# Altium schematic sheet uInverter.SchDoc: uInverter
size Letter; Engineer: Nikhil Deshpande; Revision: A; SheetNumber: 1; SheetTotal: 3
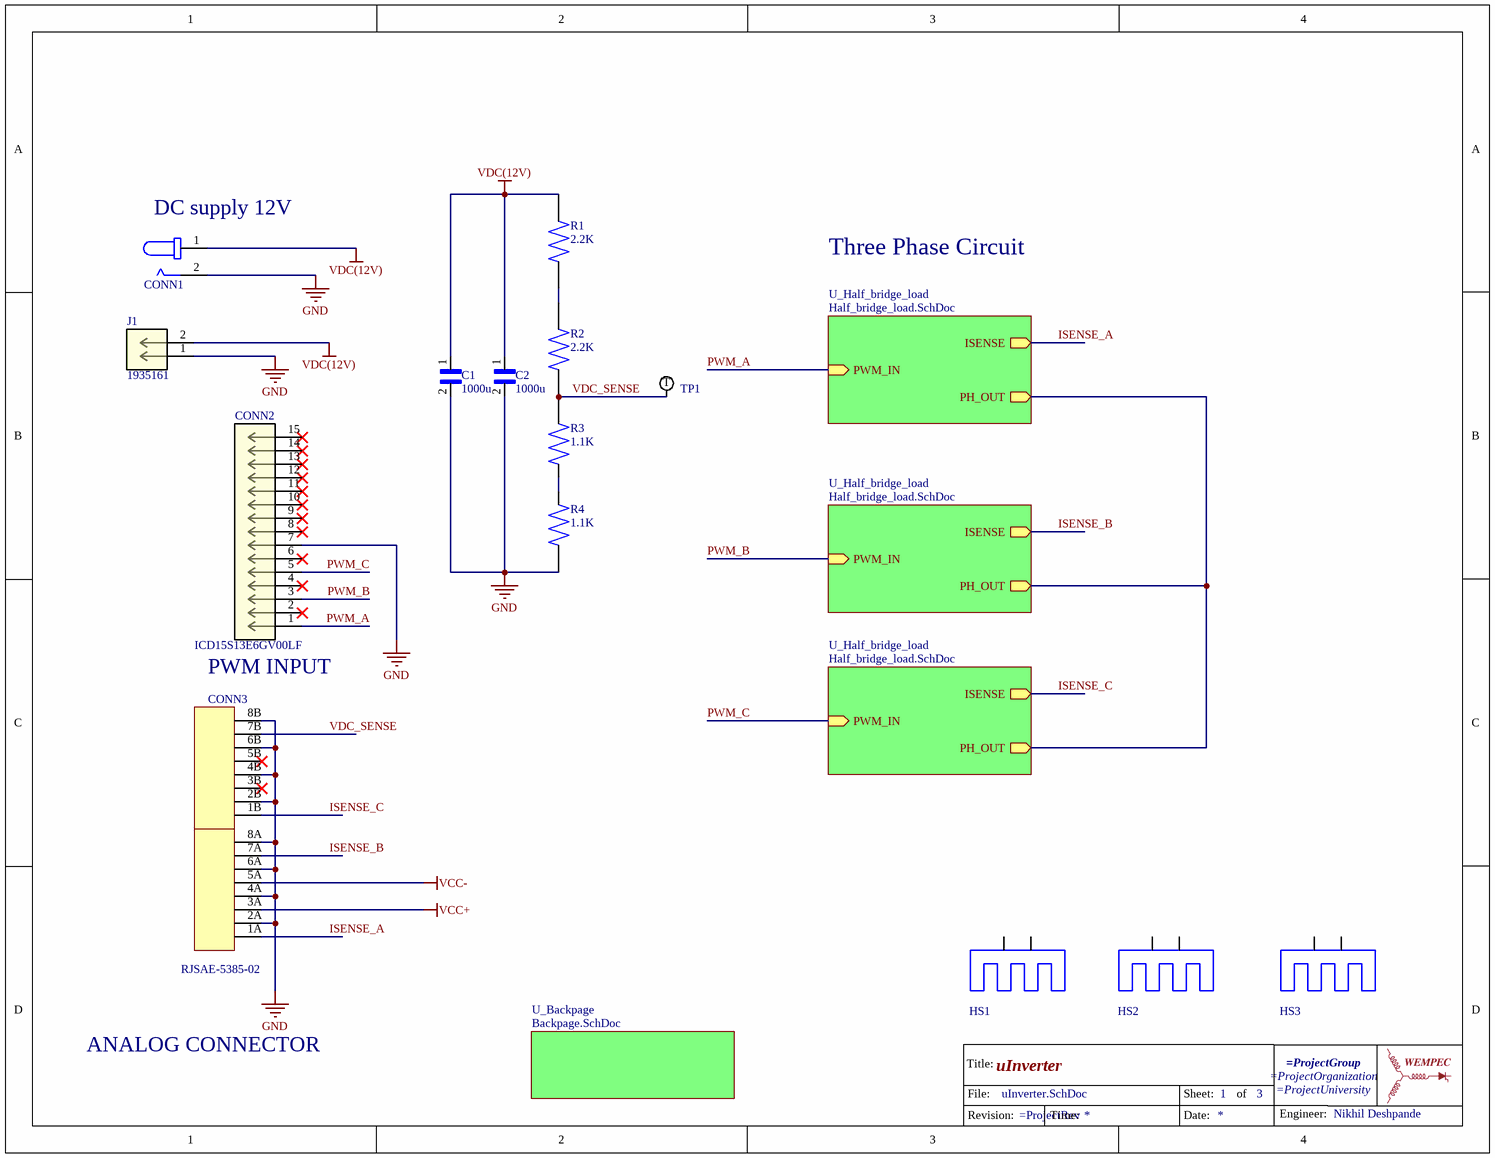
[diagram p0: uInverter.SchDoc]

## Parts
C1  1000u  [CAP_PAN_12.5X25_PAN]
C2  1000u  [CAP_PAN_12.5X25_PAN]
CONN1  PJ-037AH  [CUI_PJ-037AH]  (value not drawn)
CONN2  ICD15S13E6GV00LF  [ICD15S13E6GV00LF]
CONN3  RJSAE-5385-02  [CONN_RJSAE538502_AMP]
HS1  530002B02500G  [530002]  (value not drawn)
HS2  530002B02500G  [530002]  (value not drawn)
HS3  530002B02500G  [530002]  (value not drawn)
J1  1935161  [PHOENIX_1935161]
R1  2.2K  [0603_RES]
R2  2.2K  [0603_RES]
R3  1.1K  [0603_RES]
R4  1.1K  [0603_RES]
TitleBlockWEMPEC1  TitleBlockWEMPEC  (value not drawn)
TP1  Test Point  [TP_1.6MM]  (value not drawn)

## Sub-sheets
U_Backpage = Backpage.SchDoc: no entries
U_Half_bridge_load = Half_bridge_load.SchDoc: ISENSE (out), PWM_IN (in), PH_OUT (out)
U_Half_bridge_load = Half_bridge_load.SchDoc: ISENSE (out), PWM_IN (in), PH_OUT (out)
U_Half_bridge_load = Half_bridge_load.SchDoc: ISENSE (out), PWM_IN (in), PH_OUT (out)

## Nets
GND: C1.2 C2.2 CONN1.2 CONN2.7 CONN3.2A CONN3.2B CONN3.4A CONN3.4B CONN3.6A CONN3.6B CONN3.8A CONN3.8B J1.1 R4.2
VCC+: CONN3.3A
VCC-: CONN3.5A
VDC(12V): C1.1 C2.1 CONN1.1 J1.2 R1.1
ISENSE_A: CONN3.1A ; sheet U_Half_bridge_load/ISENSE
ISENSE_B: CONN3.7A ; sheet U_Half_bridge_load/ISENSE
ISENSE_C: CONN3.1B ; sheet U_Half_bridge_load/ISENSE
PWM_A: CONN2.1 ; sheet U_Half_bridge_load/PWM_IN
PWM_B: CONN2.3 ; sheet U_Half_bridge_load/PWM_IN
PWM_C: CONN2.5 ; sheet U_Half_bridge_load/PWM_IN
VDC_SENSE: CONN3.7B R2.2 R3.1 TP1.1
NetR1_2: R1.2 R2.1
NetR3_2: R3.2 R4.1
(unnamed): sheet U_Half_bridge_load/PH_OUT, sheet U_Half_bridge_load/PH_OUT, sheet U_Half_bridge_load/PH_OUT

Not connected (* = marked no-connect by the designer): CONN2 2* 4* 6* 8* 9* 10* 11* 12* 13* 14* 15*; CONN3 3B(79)* 5B(79)*; HS1 P$1(1) P$2(2); HS2 P$1(1) P$2(2); HS3 P$1(1) P$2(2)

## Notes on the sheet
- (near CONN1) DC supply 12V
- Three Phase Circuit
- PWM INPUT
- ANALOG CONNECTOR
- (in symbol Test Point 36-5005ND) T
- (in symbol TitleBlockWEMPEC) Title:; File:; Sheet:; of; Engineer:; Revision:; Time:; Date:

## Library data of the parts
C1 C2 = EEU-FM1V102B: Cap Aluminum 1000uF 35V 20% (12.5 X 25mm) Radial 5mm 3190mA 7000 hr 105C Ammo Pack; Manufacturer: Panasonic; Capacitance: 1mF; Ripple Current: 3.19A; Life (Hours): 7000Hour; Impedance: 15mR; Polarity: Polar; Lead Diameter: 0.6mm; Supplier 1: Digi-Key; Manufacturer Part Number: EEU-FM1V102B; RoHS: Yes; Category: Aluminum Electrolytic Capacitors; Stock 1: 691; Pricing 1: 1=1.11000, 10=0.84300, 50=0.70060, 100=0.60330 (USD); Mount: Through Hole; Case/Package: Radial; Min Operating Temperature: -40°C; Max Operating Temperature: 105°C; Tolerance: 20%; Termination: Radial; Voltage Rating: 35V; Packaging: Tape and Reel; Package Quantity: 500; Voltage Rating (DC): 35V; ESR (Equivalent Series Resistance): 15mR; Series: FM; Construction: RADIAL; Diameter: 12mm; Length: 25mm; Height: 25mm; Lead Pitch: 5mm; Height - Seated (Max): 1.063inch; Radiation Hardening: No; Lead Free: Lead Free; RoHS Compliant: Yes; ComponentLink1URL: https://datasheet.ciiva.com/11676/aba0000ce108-11676917.pdf?src-supplier=Avnet; ComponentLink1Description: https://datasheet.ciiva.com/11676/aba0000ce108-11676917.pdf?src-supplier=Avnet; Supplier Part Number 1: P19719CT-ND
CONN1 = PJ-037AH: CONN PWR JACK 2X5.5MM SOLDER; Manufacturer: CUI; Shielding: Unshielded; Gender: Male; Current Rating: 5A; Number of Conductors: 2; Voltage Rating: 24V; Insulation Resistance: 100MR; Supplier 1: Digi-Key; Manufacturer Part Number: PJ-037AH; RoHS: Yes; Category: Connectors; Stock 1: 11304; Pricing 1: 1=0.71000, 10=0.66600, 25=0.59920, 50=0.53280, 100=0.51060, 250=0.46620, 500=0.44400, 1000=0.36630, 2500=0.33300 (USD); Mount: Through Hole; Color: Black; Contact Material: Copper; Contact Plating: Nickel; Housing Color: Black; Housing Material: Thermoplastic; Min Operating Temperature: -25°C; Max Operating Temperature: 85°C; Connector Type: Jack; Termination: Solder; Package Quantity: 500; Contact Gender: Male; Orientation: Horizontal; Series: -; Flammability Rating: UL94 V-0; Lead Free: Lead Free; RoHS Compliant: Yes; ComponentLink1URL: http://www.mouser.com/ds/2/670/pj-037ah-516064.pdf?src-supplier=Mouser; ComponentLink1Description: http://www.mouser.com/ds/2/670/pj-037ah-516064.pdf?src-supplier=Mouser; ComponentLink2URL: https://www.cui.com/product/resource/digikeypdf/pj-037ah.pdf?src-supplier=Digi-Key; ComponentLink2Description: https://www.cui.com/product/resource/digikeypdf/pj-037ah.pdf?src-supplier=Digi-Key; Supplier Part Number 1: CP-037AH-ND
CONN2 = ICD15S13E6GV00LF: Conn High Density D-Sub SKT 15 POS 2.28mm Solder RA Thru-Hole 15 Terminal 1 Port; Manufacturer: Amphenol FCI; Plating: Bright,Tin,Steel,Chrome; Body Material: Metal,Steel; Number of Terminals/Pins: 15; Mating Cycles: 500; Voltage Rating: 300V; Current Rating: 3A; Gender: Female; Connector Type: D-Sub,Receptacle,Signal; Number of Ports: 1; Supplier 1: Digi-Key; Manufacturer Part Number: ICD15S13E6GV00LF; RoHS: Yes; Category: D-Sub Connectors; Stock 1: 3485; Pricing 1: 1=2.28000, 10=2.06800, 25=1.94120, 50=1.85680, 100=1.77230, 250=1.60352, 500=1.47692, 1000=1.26593, 2500=1.18154 (USD); Mount: Through Hole; Case/Package: Metal; Color: Black; Contact Plating: Gold,Tin,Matte; Contact Material: Copper Alloy; Housing Color: Black; Housing Material: Steel; Min Operating Temperature: -55°C; Max Operating Temperature: 125°C; Packaging: Bulk; Package Quantity: 100; Number of Rows: 3; Max Voltage Rating (AC): 300V; Number of Positions: 15; Termination: Solder; Number of Contacts: 15; Max Supply Voltage (AC): 300V; Orientation: Right Angle; Length: 30.81mm; Width: 12.58mm; Pitch: 2.28mm; Depth: 21.7mm; Radiation Hardening: No; REACH SVHC: No SVHC; Lead Free: Lead Free; Flammability Rating: UL94 V-0; ComponentLink1URL: https://datasheet.ciiva.com/22727/1728476-22727809.pdf?src-supplier=Element14; ComponentLink1Description: https://datasheet.ciiva.com/22727/1728476-22727809.pdf?src-supplier=Element14; ComponentLink2URL: https://datasheet.ciiva.com/652/c-cd-0011-652471.pdf?src-supplier=Digi-Key; ComponentLink2Description: https://datasheet.ciiva.com/652/c-cd-0011-652471.pdf?src-supplier=Digi-Key; ComponentLink3URL: https://datasheet.ciiva.com/8058/1728476-8058812.pdf?src-supplier=Element14; ComponentLink3Description: https://datasheet.ciiva.com/8058/1728476-8058812.pdf?src-supplier=Element14; Supplier Part Number 1: 609-2802-ND
CONN3 = RJSAE-5385-02: CONN MOD JACK 8P8C R/A SHIELDED; Manufacturer: Amphenol Commercial; Number of Contacts: 16; Gender: Female; Current Rating: 1.5A; Voltage Rating: 125V; Number of Ports: 2; Direction: Up and Down; Pitch: 2.54mm; Supplier 1: Digi-Key; Manufacturer Part Number: RJSAE-5385-02; RoHS: Yes; Category: Modular / Ethernet Connectors; Stock 1: 254; Pricing 1: 1=6.67000, 10=6.39000, 25=5.83440, 50=5.55660, 100=5.27880, 250=4.72312, 500=4.44528, 1000=4.01310 (USD); Mount: Through Hole; Color: Black,Green; Contact Plating: Gold; Contact Material: Bronze; Housing Material: Thermoplastic; Min Operating Temperature: -55°C; Max Operating Temperature: 85°C; Termination: Solder; Orientation: Right Angle; Package Quantity: 35; Packaging: Tray; Shielding: Shielded; Number of Rows: 2; Number of Positions Loaded: 16; Connector Type: Jack; Series: RJSAE; Length: 16.51mm; Depth: 28.15mm; Radiation Hardening: No; Lead Free: Lead Free; RoHS Compliant: Yes; ComponentLink1URL: https://datasheet.ciiva.com/26934/getdatasheetpartid-29521-26934348.pdf?src-supplier=Verical; ComponentLink1Description: https://datasheet.ciiva.com/26934/getdatasheetpartid-29521-26934348.pdf?src-supplier=Verical; Supplier Part Number 1: RJSAE-5385-02-ND
HS1-HS3 = 530002B02500G: Heat Sink Passive TO-220 Radial Thru-Hole 2.6C/W Black Anodized; MF: Aavid Thermalloy; Shape: Fins,Rectangular; Thermal Resistance @ Forced Air Flow (100 LFM): 2°C/W; Natural Thermal Resistance: 2.6°C/W; Package: None; SnapEDA_Link: https://www.snapeda.com/parts/530002B02500G/Aavid%20Thermalloy/view-part/4792019/?ref=snap; Availability: Unavailable; Value: *; MP: 530002B02500G; Price: None; Supplier 1: Digi-Key; Manufacturer: Aavid Thermalloy; Manufacturer Part Number: 530002B02500G; RoHS: Yes; Category: Heat Sinks; Stock 1: 1035; Pricing 1: 1=6.14000, 10=5.97200, 25=5.64040, 50=5.30860, 100=4.97680, 250=4.64500, 500=4.31320, 1000=4.23026 (USD); Mount: Bolt,PC Pin,Solder; Case/Package: Radial; Color: Black; Package Cooled: TO-220; Material: Aluminium,Anodized; Finish: Anodized; Type: Passive; Package Quantity: 200; Series: 5300; Length: 41.91mm; Width: 1.65inch; Height: 63.5mm; Depth: 25.4mm; Height Off Base: 1inch; Radiation Hardening: No; REACH SVHC: Unknown; Lead Free: Lead Free; RoHS Compliant: Yes; ComponentLink1URL: https://datasheet.ciiva.com/15182/getdatasheetpartid-311919-15182633.pdf?src-supplier=Verical; ComponentLink1Description: https://datasheet.ciiva.com/15182/getdatasheetpartid-311919-15182633.pdf?src-supplier=Verical; ComponentLink2URL: https://datasheet.ciiva.com/22641/1699368-22641984.pdf?src-supplier=Element14; ComponentLink2Description: https://datasheet.ciiva.com/22641/1699368-22641984.pdf?src-supplier=Element14; ComponentLink3URL: https://datasheet.ciiva.com/19457/696626-19457620.pdf?src-supplier=Jameco; ComponentLink3Description: https://datasheet.ciiva.com/19457/696626-19457620.pdf?src-supplier=Jameco; ComponentLink4URL: https://datasheet.ciiva.com/6333/aavid-board-level-heatsinks-catalog-6333980.pdf?src-supplier=Digi-Key; ComponentLink4Description: https://datasheet.ciiva.com/6333/aavid-board-level-heatsinks-catalog-6333980.pdf?src-supplier=Digi-Key; ComponentLink5URL: https://datasheet.ciiva.com/14543/70115166-14543413.pdf?src-supplier=Allied+Electronics; ComponentLink5Description: https://datasheet.ciiva.com/14543/70115166-14543413.pdf?src-supplier=Allied+Electronics; Supplier Part Number 1: HS380-ND
J1 = 1935161: Conn Terminal Blocks 2 POS 5mm Solder ST Thru-Hole 16A; Manufacturer: Phoenix Contact; Max Supply Voltage: 250V; Current Rating: 17.5A; Number of Poles: 2; Number of Levels: 1; Current: 18A; Voltage: 300V; Voltage Rating (DC): 320V; Connector Type: Screw; Wire Gauge (Max): 26AWG; Wire Gauge (Min): 12AWG; Approvals: UL; Supplier 1: Digi-Key; Manufacturer Part Number: 1935161; RoHS: Yes; Category: Terminal Blocks; Stock 1: 82071; Pricing 1: 1=0.43000, 10=0.41400, 50=0.39600, 100=0.38520, 250=0.36000, 500=0.33120, 1000=0.30600 (USD); Mount: Through Hole; Number of Pins: 2; Color: Green; Weight: 0.067021oz; Material: Nylon; Housing Color: Green; Housing Material: Polyamide; Insulation Material: Nylon; Contact Material: Copper,Tin; Number of Rows: 1; Max Current Rating: 16A; Voltage Rating: 250V; Package Quantity: 250; Packaging: Bulk; Number of Positions: 2; Number of Positions Per Level: 2; Termination: Solder; Number of Contacts: 2; Number of Circuits: 2; Orientation: Straight; Series: COMBICON PT; Number of Ways: 2; Length: 9mm; Width: 14.9mm; Height: 11.3mm; Pitch: 5mm; Depth: 9mm; Wire/Cable Gauge: 26AWG; Radiation Hardening: No; Lead Free: Lead Free; Flammability Rating: UL94 V-0; REACH SVHC: Unknown; RoHS Compliant: Yes; ComponentLink1URL: https://datasheet.ciiva.com/15169/getdatasheetpartid-177903-15169663.pdf?src-supplier=Verical; ComponentLink1Description: https://datasheet.ciiva.com/15169/getdatasheetpartid-177903-15169663.pdf?src-supplier=Verical; ComponentLink2URL: https://datasheet.ciiva.com/16047/1935161-16047247.pdf?src-supplier=Onlinecomponents.com; ComponentLink2Description: https://datasheet.ciiva.com/16047/1935161-16047247.pdf?src-supplier=Onlinecomponents.com; ComponentLink3URL: https://datasheet.ciiva.com/824/combiconcompact5-0mmseries-824222.pdf?src-supplier=Digi-Key; ComponentLink3Description: https://datasheet.ciiva.com/824/combiconcompact5-0mmseries-824222.pdf?src-supplier=Digi-Key; Supplier Part Number 1: 277-1667-ND
R1 R2 = RCS06032K49FKEA: Res Thick Film 0603 2.49K Ohm 1% 1/4W ±100ppm/°C Molded SMD Paper T/R; Manufacturer: Vishay Dale; Resistance: 2.49kR; Max Power Dissipation: 250mW; Supplier 1: Digi-Key; Manufacturer Part Number: RCS06032K49FKEA; RoHS: Yes; Category: Chip SMD Resistors; Pricing 1: 1=0.14000, 10=0.12700, 100=0.04900, 1000=0.02154, 2500=0.01860 (USD); Case/Package: 0603; Min Operating Temperature: -55°C; Max Operating Temperature: 155°C; Package Quantity: 5000; Packaging: Tape and Reel; Resistor Type: Thick Film; Number of Terminations: 2; Features: Automotive AEC-Q200; Tolerance: 1%; Temperature Coefficient: 100ppm/°C; Length: 0.061inch; Width: 0.033inch; Height: 0.02inch; ComponentLink1URL: http://www.vishay.com/docs/20065/rcse3.pdf?src-supplier=Digi-Key; ComponentLink1Description: http://www.vishay.com/docs/20065/rcse3.pdf?src-supplier=Digi-Key; Supplier Part Number 1: 541-RCS06032K49FKEACT-ND
R3 R4 = RCS06031K10FKEA: RES SMD 1.1K OHM 1% 1/4W 0603; Manufacturer: Vishay Dale; Max Power Dissipation: 250mW; Temperature Coefficient: 100ppm/°C; Resistance: 1.1kR; Supplier 1: Digi-Key; Manufacturer Part Number: RCS06031K10FKEA; RoHS: Yes; Category: Chip SMD Resistors; Stock 1: 4990; Pricing 1: 1=0.14000, 10=0.12700, 100=0.04900, 1000=0.02154, 2500=0.01860 (USD); Case/Package: 0603; Min Operating Temperature: -55°C; Max Operating Temperature: 155°C; Tolerance: 1%; Features: Automotive AEC-Q200; Package Quantity: 5000; Packaging: Tape and Reel; Resistor Type: Thick Film; Number of Terminations: 2; Length: 0.061inch; Width: 0.033inch; Height: 0.02inch; ComponentLink1URL: http://www.vishay.com/docs/20065/rcse3.pdf?src-supplier=Digi-Key; ComponentLink1Description: http://www.vishay.com/docs/20065/rcse3.pdf?src-supplier=Digi-Key; Supplier Part Number 1: 541-RCS06031K10FKEACT-ND
TP1 = Test Point 36-5005ND: Conn Test Point SKT 1 POS ST Thru-Hole 1 Port; Material - Insulation: No Insulation; Body Material: PBT; Number of Ports: 1; Inside Diameter: 1.78mm; Outside Diameter: 3.18mm; Hole Diameter: 1.6mm; Supplier Part Number: *; Supplier: *; Footprint: *; RoHS: RoHS Compliant; Category: Test and Measurement; Stock 1: 136646; Pricing 1: 1=0.22, 10=0.206, 25=0.1756, 50=0.1536, 100=0.1426, 250=0.12616, 500=0.12068, 1000=0.09874 (USD); Packaging: Cut Tape (CT); Part Status: Active; Type: PC Test Point; Mounting Type: Surface Mount; Color: Natural; Size / Dimension: 0.063" x 0.031" x 0.045" (1.60mm x 0.80mm x 1.15mm); Plating: -; Material - Body: -; ComponentLink1URL: http://www.te.com/commerce/DocumentDelivery/DDEController?Action=srchrtrv&DocNm=1773266&DocType=DS&DocLang=English; ComponentLink1Description: http://www.te.com/commerce/DocumentDelivery/DDEController?Action=srchrtrv&DocNm=1773266&DocType=DS&DocLang=English; Stock 2: 147226; Pricing 2: 1=0.42000, 25=0.34080, 100=0.30150, 250=0.28304, 500=0.25230, 1000=0.19884, 2500=0.18180, 5000=0.17044 (USD); Mount: PCB,Through Hole; Contact Material: Bronze; Contact Plating: Silver,Tin; Material: Nylon,Bronze,Silver; Housing Color: Red; Termination: Solder; Orientation: Straight; Series: THM; Package Quantity: 100; Length: 8.89mm; Height: 0.35inch; Lead Free: Lead Free; REACH SVHC: No SVHC; Flammability Rating: UL94 V-0; RoHS Compliant: Yes; ComponentLink2URL: https://datasheet.ciiva.com/11744/0900766b8009b7c7-11744948.pdf?src-supplier=RSComponents; ComponentLink2Description: https://datasheet.ciiva.com/11744/0900766b8009b7c7-11744948.pdf?src-supplier=RSComponents; ComponentLink3URL: https://datasheet.ciiva.com/2917/m60-2p60-2917633.pdf?src-supplier=Digi-Key; ComponentLink3Description: https://datasheet.ciiva.com/2917/m60-2p60-2917633.pdf?src-supplier=Digi-Key; ComponentLink4URL: https://datasheet.ciiva.com/16508/m60-2p60-16508073.pdf?src-supplier=Future+Electronics; ComponentLink4Description: https://datasheet.ciiva.com/16508/m60-2p60-16508073.pdf?src-supplier=Future+Electronics; ComponentLink5URL: https://datasheet.ciiva.com/1454/1703983-1454828.pdf?src-supplier=Element14; ComponentLink5Description: https://datasheet.ciiva.com/1454/1703983-1454828.pdf?src-supplier=Element14; ComponentLink6URL: https://datasheet.ciiva.com/16883/70182825-16883781.pdf?src-supplier=Allied+Electronics; ComponentLink6Description: https://datasheet.ciiva.com/16883/70182825-16883781.pdf?src-supplier=Allied+Electronics; Supplier 1: Digi-Key; Supplier Part Number 1: 36-5005-ND